# EAGLE schematic BikeLight (EAGLE 9.5.1)
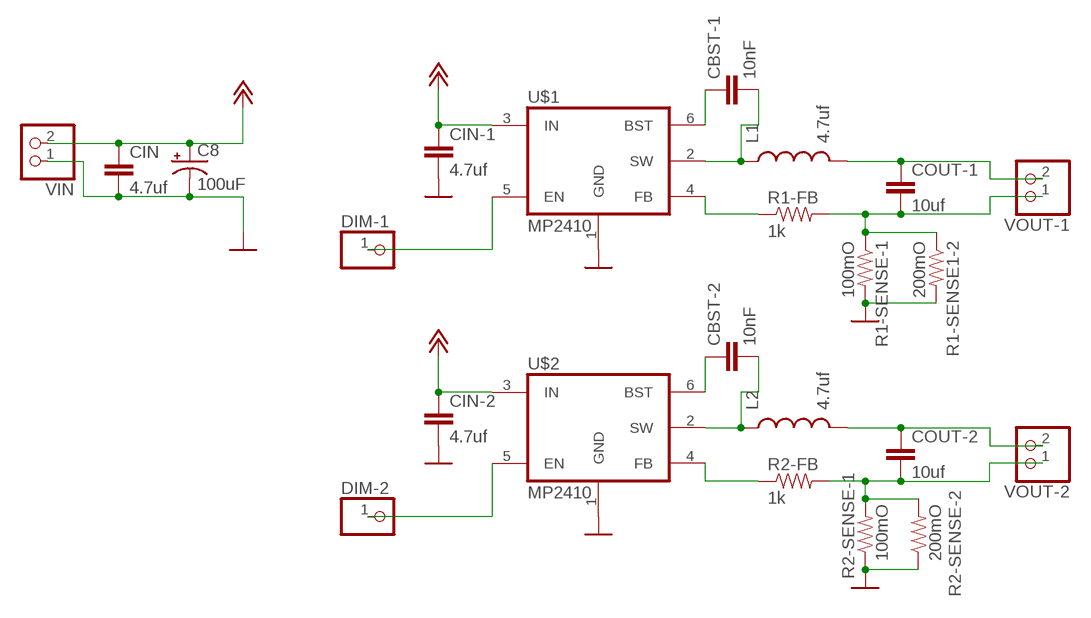
[diagram p0: schematic, sheet 1]

## Parts
C8  100uF  100UF-POLAR-10X10.5-63V-20%  [NIC_10X10.5_CAP]
CBST-1  10nF  CAP0805  [0805]
CBST-2  10nF  CAP0805  [0805]
CIN  4.7uf  CAP1206  [1206]
CIN-1  4.7uf  CAP1206  [1206]
CIN-2  4.7uf  CAP1206  [1206]
COUT-1  10uf  CAP1210  [1210]
COUT-2  10uf  CAP1210  [1210]
DIM-1  PINHD-1X1  [1X01]
DIM-2  PINHD-1X1  [1X01]
L1  4.7uf  INDUCTORRLB0912  [RLB0912]
L2  4.7uf  INDUCTORRLB0912  [RLB0912]
R1-FB  1k  RESISTOR0805-RES  [0805]
R1-SENSE1-2  200mO  RESISTOR1206  [1206]
R1-SENSE-1  100mO  RESISTOR1206  [1206]
R2-FB  1k  RESISTOR0805-RES  [0805]
R2-SENSE-1  100mO  RESISTOR1206  [1206]
R2-SENSE-2  200mO  RESISTOR1206  [1206]
U$1  MP2410  [TSOT23-6]
U$2  MP2410  [TSOT23-6]
VIN  PINHD-1X2  [1X02]
VOUT-1  PINHD-1X2  [1X02]
VOUT-2  PINHD-1X2  [1X02]

## Nets
+12V: C8.+ CIN-1.1 CIN-2.1 CIN.1 U$1.3(IN) U$2.3(IN) VIN.2
GND: C8.- CIN-1.2 CIN-2.2 CIN.2 R1-SENSE1-2.2 R1-SENSE-1.2 R2-SENSE-1.1 R2-SENSE-2.1 U$1.1(GND) U$2.1(GND) VIN.1
N$1: DIM-2.1 U$2.5(EN)
N$2: DIM-1.1 U$1.5(EN)
N$3: CBST-1.2 L1.1 U$1.2(SW)
N$4: COUT-1.1 L1.2 VOUT-1.2
N$5: CBST-2.2 L2.1 U$2.2(SW)
N$6: COUT-2.1 L2.2 VOUT-2.2
N$7: CBST-1.1 U$1.6(BST)
N$8: R1-FB.1 U$1.4(FB)
N$9: COUT-2.2 R2-FB.2 R2-SENSE-1.2 R2-SENSE-2.2 VOUT-2.1
N$10: R2-FB.1 U$2.4(FB)
N$11: CBST-2.1 U$2.6(BST)
N$12: COUT-1.2 R1-FB.2 R1-SENSE1-2.1 R1-SENSE-1.1 VOUT-1.1

## Library data of the parts
C8 = SparkFun-Capacitors:100UF-POLAR: 100µF polarized capacitors A capacitor is a passive two-terminal electrical component used to store electrical energy temporarily in an electric field.; PROD_ID: CAP-08362
CBST-1 CBST-2 CIN CIN-1 CIN-2 COUT-1 COUT-2 = SparkFun-Passives:CAP: Capacitor Standard 0603 ceramic capacitor, and 0.1" leaded capacitor.
DIM-1 DIM-2 = pinhead:PINHD-1X1: PIN HEADER
L1 L2 = SparkFun-Passives:INDUCTOR: Inductors Basic Inductor/Choke - 0603 and 1206. Footprints are not proven and vary greatly between part numbers. SRN6045- 33uH, 20% 1.4A SDR0403-560KL - 56uH, 10%, 500mA RMS/740mA peak
R1-FB R1-SENSE1-2 R1-SENSE-1 R2-FB R2-SENSE-1 R2-SENSE-2 = SparkFun-Passives:RESISTOR: Resistor Basic schematic elements and footprints for 0603, 1206, and PTH resistors.
U$1 U$2 = CustomParts:MP2410: The MP2410 is a 24V, monolithic, synchronous, step-down, white LED driver with a built-in power MOSFET and rectifier.
VIN VOUT-1 VOUT-2 = pinhead:PINHD-1X2: PIN HEADER